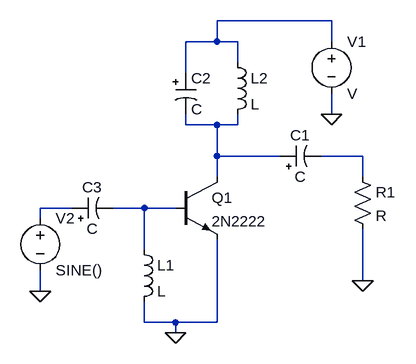
[diagram p0: schematic class c.asc]
class c.asc, the LTspice schematic file:
Version 4
SHEET 1 1132 680
WIRE 400 -176 224 -176
WIRE 224 -144 224 -176
WIRE 224 -144 176 -144
WIRE 256 -144 224 -144
WIRE 400 -144 400 -176
WIRE 256 -112 256 -144
WIRE 176 -96 176 -144
WIRE 400 -32 400 -64
WIRE 176 -16 176 -32
WIRE 224 -16 176 -16
WIRE 256 -16 256 -32
WIRE 256 -16 224 -16
WIRE 224 32 224 -16
WIRE 320 32 224 32
WIRE 448 32 384 32
WIRE 224 64 224 32
WIRE 448 64 448 32
WIRE 0 112 -48 112
WIRE 112 112 64 112
WIRE 160 112 112 112
WIRE -48 128 -48 112
WIRE 112 176 112 112
WIRE 448 224 448 144
WIRE -48 240 -48 208
WIRE 112 288 112 256
WIRE 160 288 112 288
WIRE 224 288 224 160
WIRE 224 288 160 288
WIRE 160 304 160 288
FLAG 448 224 0
FLAG 160 304 0
FLAG -48 240 0
FLAG 400 -32 0
SYMBOL npn 160 64 R0
SYMATTR InstName Q1
SYMATTR Value 2N2222
SYMBOL polcap 320 48 R270
WINDOW 0 32 32 VTop 2
WINDOW 3 0 32 VBottom 2
SYMATTR InstName C1
SYMBOL polcap 160 -96 R0
SYMATTR InstName C2
SYMBOL polcap 0 128 R270
WINDOW 0 32 32 VTop 2
WINDOW 3 0 32 VBottom 2
SYMATTR InstName C3
SYMBOL ind 96 160 R0
SYMATTR InstName L1
SYMBOL ind 240 -128 R0
SYMATTR InstName L2
SYMBOL res 432 48 R0
SYMATTR InstName R1
SYMBOL voltage 400 -160 R0
SYMATTR InstName V1
SYMBOL voltage -48 112 R0
WINDOW 123 0 0 Left 0
WINDOW 39 0 0 Left 0
SYMATTR InstName V2
SYMATTR Value SINE()

The netlist it stands for:
* class c.asc
Q1 N002 N005 0 0 2N2222
C1 N002 N003 C
C2 N001 N002 C
C3 N004 N005 C
L1 N005 0 L
L2 N001 N002 L
R1 N003 0 R
V1 N001 0 V
V2 N004 0 SINE()
.model NPN NPN
.model PNP PNP
.lib standard.bjt
.backanno
.end